# Altium schematic sheet frontpanel_interconnect.SchDoc
size A
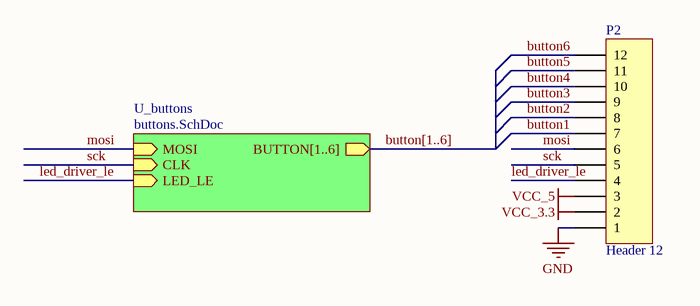
[diagram p0: frontpanel_interconnect.SchDoc]

## Parts
P2  Header 12  [HDR1X12]

## Sub-sheets
U_buttons = buttons.SchDoc: BUTTON[1..6] (out), MOSI (in), CLK (in), LED_LE (in)

## Nets
GND: P2.1
VCC_3.3: P2.2
VCC_5: P2.3
button1: P2.7
button2: P2.8
button3: P2.9
button4: P2.10
button5: P2.11
button6: P2.12
led_driver_le: P2.4 ; sheet U_buttons/LED_LE
mosi: P2.6 ; sheet U_buttons/MOSI
sck: P2.5 ; sheet U_buttons/CLK

## Buses and harness runs
bus button[1..6] = sheet U_buttons/BUTTON[1..6]

## Library data of the parts
P2 = Header 12: Header, 12-Pin; LatestRevisionDate: 17-Jul-2002; LatestRevisionNote: Re-released for DXP Platform.; Publisher: Altium Limited